# Altium project Gate_Level_Modeling.PrjPcb
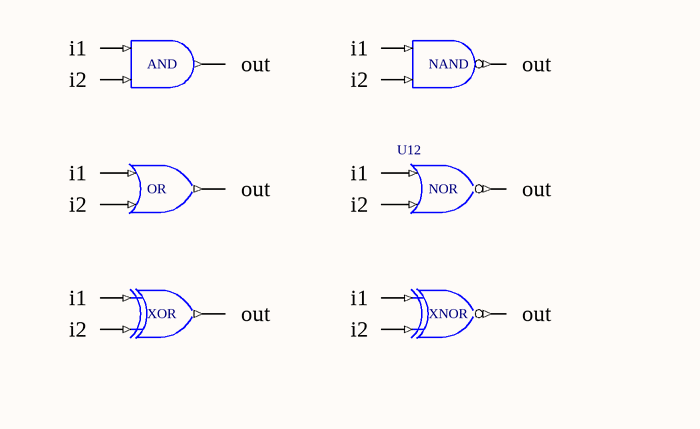
[diagram p0: 05_01_Basic_Gates.SchDoc]
8 sheets, 29 parts. Net scope: global (net labels, ports and power ports of the same name join across sheets).
Sheets:
  05_01_Basic_Gates.SchDoc
  05_02_Truth_Tables.SchDoc
  05_03_Buf_and_Not_Gates.SchDoc
  05_04_Bufif_and_Notif.SchDoc
  05_05_mux_schem.SchDoc
  05_06_mux_gate.SchDoc
  05_08_4bit_Ripple_Carry_Full_Adder.SchDoc
  S_R_Latch.SchDoc

## Sheet 05_01_Basic_Gates.SchDoc
size 111 x 66 mm

### Parts
(Parts that share a designator on the sheet are numbered #1, #2 ... from top to bottom, then left to right.)
U9#1  AND
U10  NAND
U11  OR
U12  NOR
U13  XOR
U14  XNOR

### Nets
GND: U13.7(GND)
VDD: U13.14(VDD)

Not connected (* = marked no-connect by the designer): U9#1 A B Y; U10 A B Y; U11 A B Y; U12 A B Y; U13 1(A) 2(B) 3(Y); U14 1(A) 2(B) 3(Y)

### Notes on the sheet
- (near U9#1) i1
- (near U9#1) out
- (near U10) i1
- (near U10) out
- (near U9#1) i2
- (near U10) i2
- (near U11) i1
- (near U11) i2
- (near U11) out
- (near U12) i1
- (near U12) i2
- (near U12) out
- (near U13) i1
- (near U14) i1
- (near U13) i2
- (near U13) out
- (near U14) i2
- (near U14) out

### Library data of the parts
U9#1 U10 = AND: 2 Input AND
U11 U12 = OR: 2 Input OR
U14 = XOR

## Sheet 05_02_Truth_Tables.SchDoc
size 111 x 66 mm
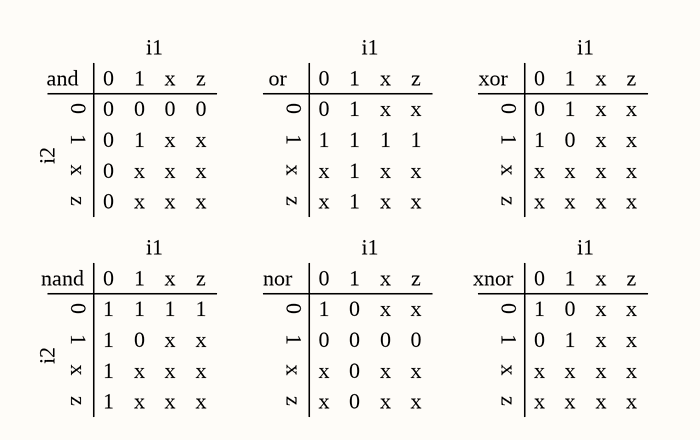
[diagram p1: 05_02_Truth_Tables.SchDoc]

### Notes on the sheet
- and
- 0
- 1
- i1
- x
- z
- or
- xor
- i2
- nand
- nor
- xnor

## Sheet 05_03_Buf_and_Not_Gates.SchDoc
size 111 x 66 mm
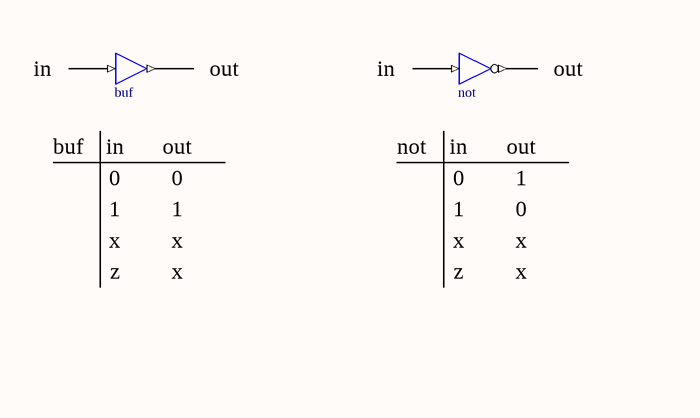
[diagram p2: 05_03_Buf_and_Not_Gates.SchDoc]

### Parts
(Parts that share a designator on the sheet are numbered #1, #2 ... from top to bottom, then left to right.)
U?#1  buf
U?#2  not

### Nets

Not connected (* = marked no-connect by the designer): U?#1 I O; U?#2 I O

### Notes on the sheet
- in
- out
- buf
- 0
- 1
- not
- x
- z

### Library data of the parts
U?#1 U?#2 = BUF: 1-bit General Purpose (Non-inverting) Buffer

## Sheet 05_04_Bufif_and_Notif.SchDoc
size 142 x 66 mm
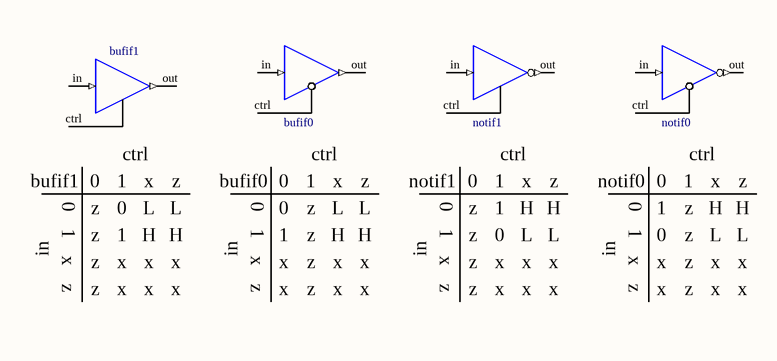
[diagram p3: 05_04_Bufif_and_Notif.SchDoc]

### Parts
(Parts that share a designator on the sheet are numbered #1, #2 ... from top to bottom, then left to right.)
U?#3  bufif0
U?#4  notif1
U?#5  notif0
U?#6  bufif1

### Nets

Not connected (* = marked no-connect by the designer): U?#3 ctrl in out; U?#4 ctrl in out; U?#5 ctrl in out; U?#6 ctrl in out

### Notes on the sheet
- (near U?#6) bufif1
- (near U?#6) 0
- (near U?#6) 1
- (near U?#6) ctrl
- (near U?#6) x
- (near U?#6) z
- bufif0
- 0
- 1
- (near U?#3) ctrl
- x
- z
- notif1
- (near U?#4) ctrl
- notif0
- (near U?#5) ctrl
- in
- L
- H

## Sheet 05_05_mux_schem.SchDoc
size 101 x 81 mm
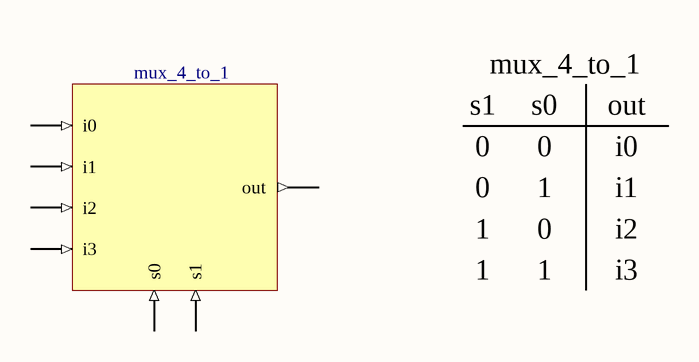
[diagram p4: 05_05_mux_schem.SchDoc]

### Parts
U8  mux_4_to_1

### Nets

Not connected (* = marked no-connect by the designer): U8 i0 i1 i2 i3 out s0 s1

### Notes on the sheet
- mux_4_to_1
- s1
- 0
- s0
- out
- i0
- 1
- i1
- i2
- i3

## Sheet 05_06_mux_gate.SchDoc
size 101 x 81 mm
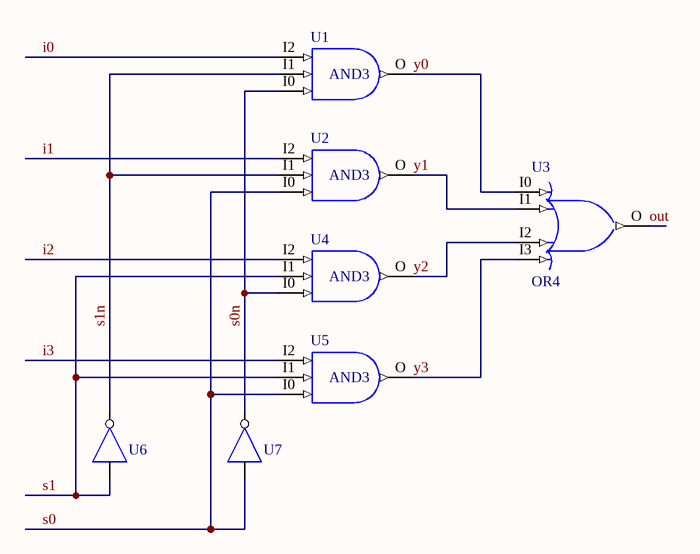
[diagram p5: 05_06_mux_gate.SchDoc]

### Parts
U1  AND3
U2  AND3
U3  OR4
U4  AND3
U5  AND3
U6  not  (value not drawn)
U7  not  (value not drawn)

### Nets
i0: U1.I2
i1: U2.I2
i2: U4.I2
i3: U5.I2
out: U3.O
s0: U2.I0 U5.I0 U7.i
s0n: U1.I0 U4.I0 U7.o
s1: U4.I1 U5.I1 U6.i
s1n: U1.I1 U2.I1 U6.o
y0: U1.O U3.I0
y1: U2.O U3.I1
y2: U3.I2 U4.O
y3: U3.I3 U5.O

### Library data of the parts
U1 U2 U4 U5 = AND3: 3-Input AND Gate; FPGAVendor: CUPL; Published: 17/04/2002 5:24:18 PM; DatasheetDocument: 1999; Publisher: Altium Limited
U3 = OR4: 4-Input OR Gate; FPGAVendor: CUPL; Published: 17-Apr-2002; Publisher: Altium Limited
U6 U7 = BUF: as U?#1 on sheet 05_03_Buf_and_Not_Gates

## Sheet 05_08_4bit_Ripple_Carry_Full_Adder.SchDoc
size 81 x 101 mm
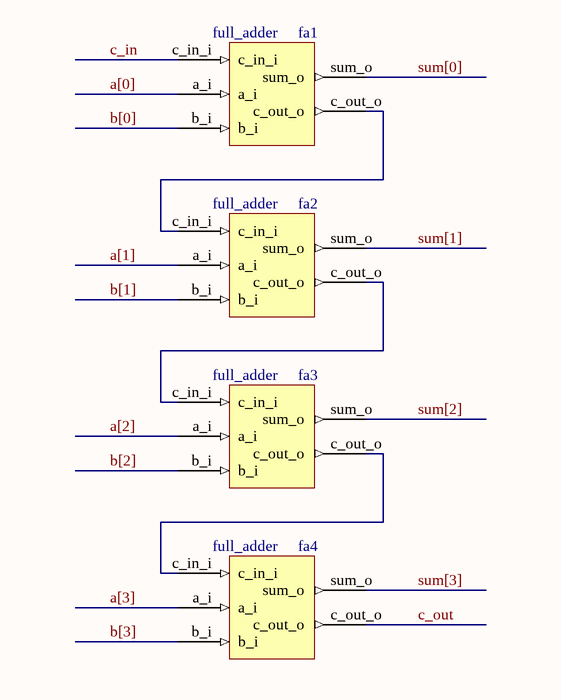
[diagram p6: 05_08_4bit_Ripple_Carry_Full_Adder.SchDoc]

### Parts
fa1  full_adder
fa2  full_adder
fa3  full_adder
fa4  full_adder

### Nets
a[0]: fa1.a_i
a[1]: fa2.a_i
a[2]: fa3.a_i
a[3]: fa4.a_i
b[0]: fa1.b_i
b[1]: fa2.b_i
b[2]: fa3.b_i
b[3]: fa4.b_i
c_in: fa1.c_in_i
c_out: fa4.c_out_o
sum[0]: fa1.sum_o
sum[1]: fa2.sum_o
sum[2]: fa3.sum_o
sum[3]: fa4.sum_o
Netfa1_c_out_o: fa1.c_out_o fa2.c_in_i
Netfa2_c_out_o: fa2.c_out_o fa3.c_in_i
Netfa3_c_out_o: fa3.c_out_o fa4.c_in_i

## Sheet S_R_Latch.SchDoc
size A
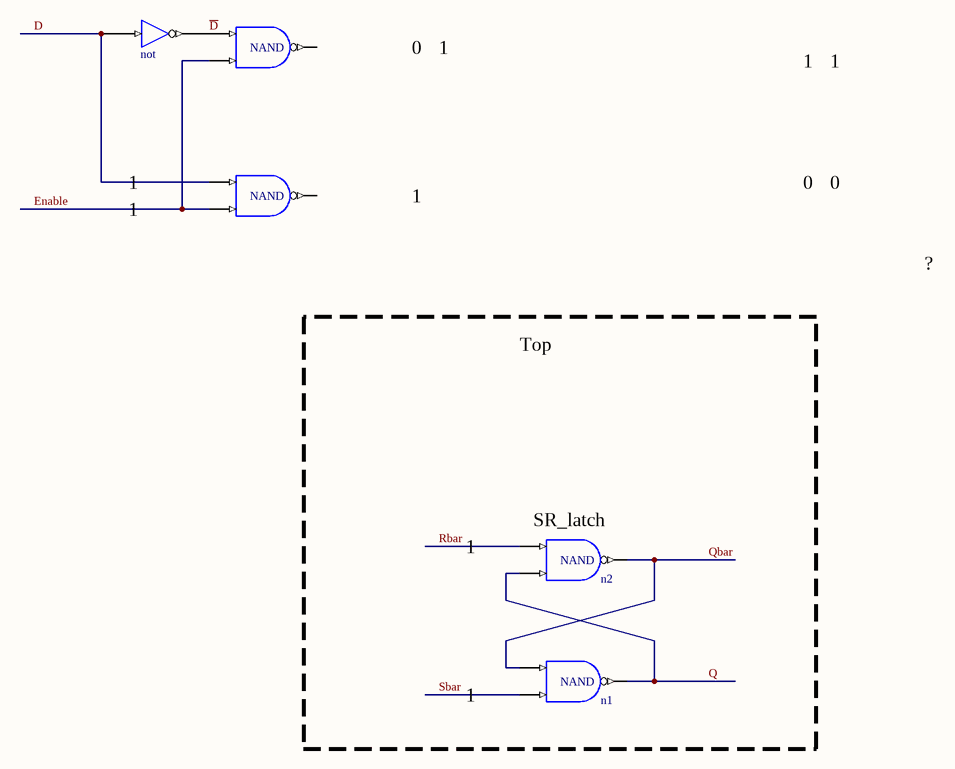
[diagram p7: S_R_Latch.SchDoc]

### Parts
(Parts that share a designator on the sheet are numbered #1, #2 ... from top to bottom, then left to right.)
n1  NAND
n2  NAND
U9#2  NAND
U9#3  NAND
U16  not

### Nets
D: U9#3.A U16.I
~{D}: U9#2.A U16.O
Enable: U9#2.B U9#3.B
Q: n1.Y n2.B
Qbar: n1.A n2.Y
Rbar: n2.A
Sbar: n1.B

Not connected (* = marked no-connect by the designer): U9#2 Y; U9#3 Y

### Notes on the sheet
- 0
- 1
- ?
- Top
- (near n2) SR_latch

### Library data of the parts
n1 n2 U9#2 U9#3 = AND: 2 Input AND
U16 = BUF: as U?#1 on sheet 05_03_Buf_and_Not_Gates